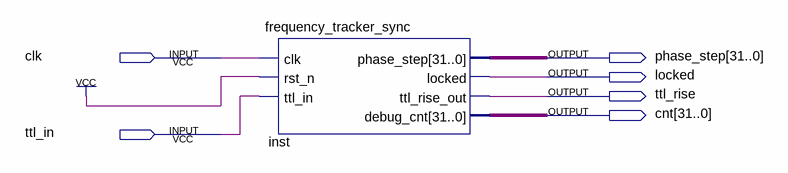
[diagram p0: schematic sheet]
// Quartus schematic frequency_tracker_test.bdf as structural Verilog: 1 symbols, 6 pins
module frequency_tracker_test (
  input  clk,
  input  ttl_in,
  output [31:0] phase_step,
  output locked,
  output ttl_rise,
  output [31:0] cnt
);

  frequency_tracker_sync inst (
    .clk(clk), .rst_n(1'b1), .ttl_in(ttl_in), .phase_step(phase_step), .locked(locked),
    .ttl_rise_out(ttl_rise), .debug_cnt(cnt));
endmodule
